# Altium schematic sheet interface2pi.SchDoc
size A4
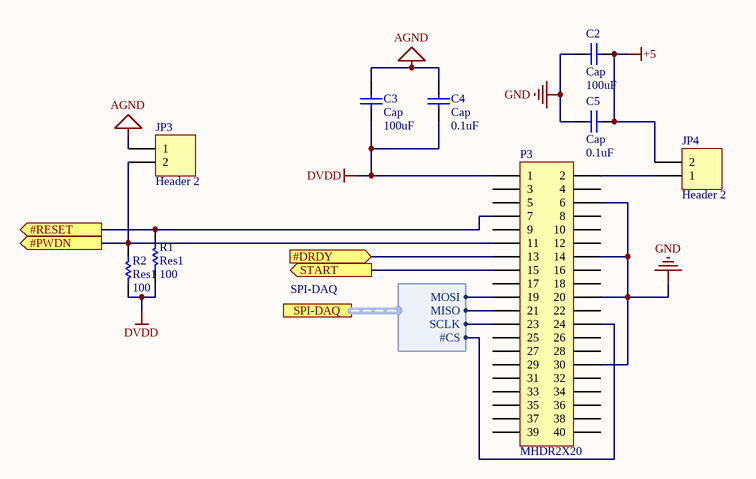
[diagram p0: interface2pi.SchDoc]

## Parts
C2  Cap  value 100uF  [14-1210]
C3  Cap  value 100uF  [14-1210]
C4  Cap  value 0.1uF  [1608[0603]]
C5  Cap  value 0.1uF  [1608[0603]]
JP3  Header 2  [HDR1X2]
JP4  Header 2  [HDR1X2]
P3  MHDR2X20  [HDR2.54-M-LS-2x20P]
R1  Res1  value 100  [1608[0603]]
R2  Res1  value 100  [1608[0603]]

## Ports
#DRDY (in), #PWDN (out), #RESET (out), SPI-DAQ (harness SPI-DAQ), START (out)

## Harnesses
SPI-DAQ: #CS, MOSI, MISO, SCLK

## Nets
+5: C2.2 C5.2 JP4.2
AGND: C3.1 C4.1 JP3.1
DVDD: C3.2 C4.2 P3.1 R1.2 R2.2
GND: C2.1 C5.1 P3.6 P3.14 P3.20 P3.30
#DRDY: P3.13 ; port #DRDY
#PWDN: JP3.2 P3.11 R2.1 ; port #PWDN
#RESET: P3.7 R1.1 ; port #RESET
START: P3.15 ; port START
NetJP4_1: JP4.1 P3.2
NetP3_19: P3.19 ; port SPI-DAQ.MOSI
NetP3_21: P3.21 ; port SPI-DAQ.MISO
NetP3_23: P3.23 ; port SPI-DAQ.SCLK
NetP3_24: P3.24 ; port SPI-DAQ.#CS

Not connected (* = marked no-connect by the designer): P3 3 4 5 8 9 10 12 16 17 18 22 25 26 27 28 29 31 32 33 34 35 36 37 38 39 40

## Library data of the parts
C2-C5 = Cap: Capacitor; Published: 8-Jun-2000; LatestRevisionDate: 17-Jul-2002; LatestRevisionNote: Re-released for DXP Platform.; PackageReference: RAD-0.3; Publisher: Altium Limited; PackageDescription: Radial Cap, Thru-Hole; 2 Leads; 0.3 in Pin Spacing
JP3 JP4 = Header 2: Header, 2-Pin; LatestRevisionDate: 17-Jul-2002; LatestRevisionNote: Re-released for DXP Platform.; Publisher: Altium Limited
P3 = MHDR2X20: Header, 20-Pin, Dual row; LatestRevisionDate: 17-Jul-2002; LatestRevisionNote: Re-released for DXP Platform.; Publisher: Altium Limited
R1 R2 = Res1: Resistor; Published: 8-Jun-2000; LatestRevisionDate: 17-Jul-2002; LatestRevisionNote: Re-released for DXP Platform.; PackageReference: AXIAL-0.3; Publisher: Altium Limited; PackageDescription: Axial Device, Thru-Hole; 2 Leads; 0.3 in Pin Spacing